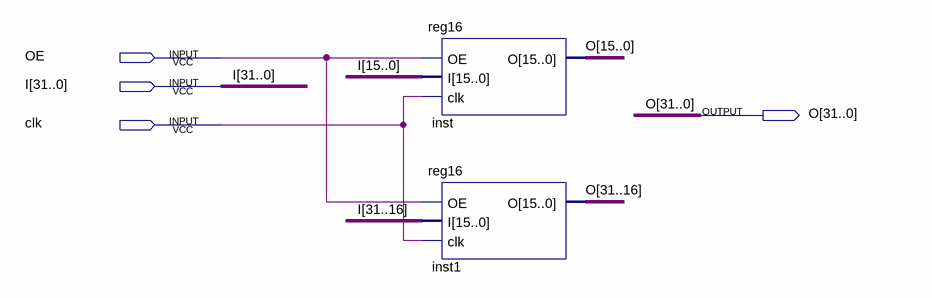
[diagram p0: schematic sheet]
// Quartus schematic Reg32.bdf as structural Verilog: 2 symbols, 4 pins
module Reg32 (
  input  OE,
  input  [31:0] I,
  input  clk,
  output [31:0] O
);

  reg16 inst (.OE(OE), .I(I[15:0]), .clk(clk), .O(O[15:0]));
  reg16 inst1 (.OE(OE), .I(I[31:16]), .clk(clk), .O(O[31:16]));
endmodule
